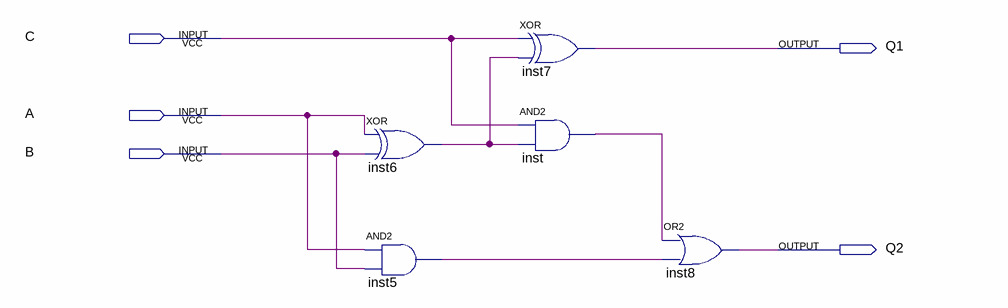
[diagram p0: schematic sheet]
// Quartus schematic Alu.bdf as structural Verilog: 5 symbols, 5 pins
module Alu (
  input  C,
  input  A,
  input  B,
  output Q1,
  output Q2
);

  wire inst5_out, inst6_out, inst_out;

  xor inst6 (inst6_out, A, B);
  and inst5 (inst5_out, A, B);
  xor inst7 (Q1, C, inst6_out);
  and inst (inst_out, C, inst6_out);
  or inst8 (Q2, inst_out, inst5_out);
endmodule
